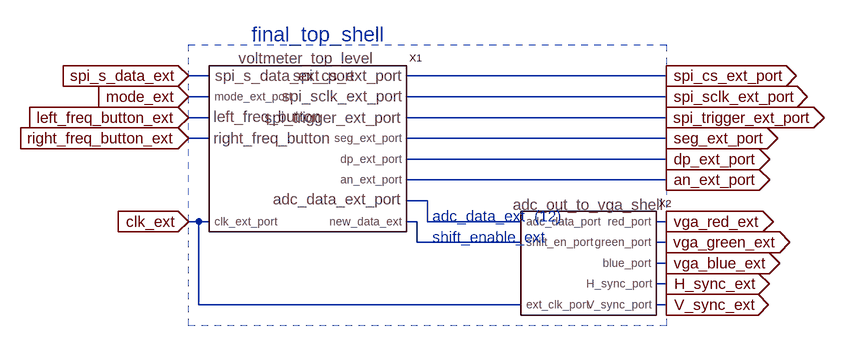
[diagram p0: schematic final_top_shell.asc]
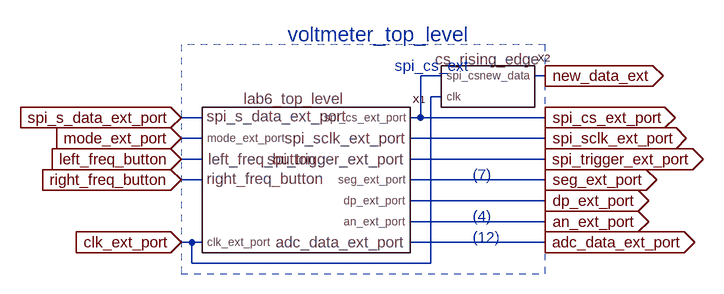
[diagram p1: sub-circuit voltmeter_shell.asc]
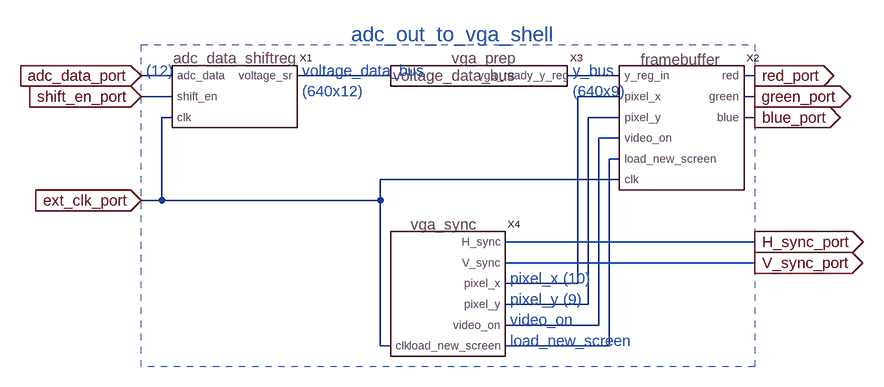
[diagram p2: sub-circuit adc_out_to_vga_shell.asc]
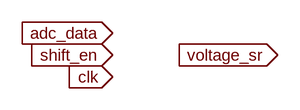
[diagram p3: sub-circuit adc_data_shiftreg.asc]
final_top_shell.asc, the LTspice schematic file:
Version 4
SHEET 1 1008 680
WIRE 48 96 16 96
WIRE 752 96 352 96
WIRE 48 128 16 128
WIRE 752 128 352 128
WIRE 48 160 16 160
WIRE 752 160 352 160
WIRE 48 192 16 192
WIRE 752 192 352 192
WIRE 752 224 352 224
WIRE 752 256 352 256
WIRE 384 288 352 288
WIRE 32 320 16 320
WIRE 48 320 32 320
WIRE 368 320 352 320
WIRE 384 320 384 288
WIRE 528 320 384 320
WIRE 752 320 736 320
WIRE 368 352 368 320
WIRE 528 352 368 352
WIRE 752 352 736 352
WIRE 752 384 736 384
WIRE 752 416 736 416
WIRE 32 448 32 320
WIRE 528 448 32 448
WIRE 752 448 736 448
FLAG 16 96 spi_s_data_ext
IOPIN 16 96 In
FLAG 16 128 mode_ext
IOPIN 16 128 In
FLAG 16 160 left_freq_button_ext
IOPIN 16 160 In
FLAG 16 192 right_freq_button_ext
IOPIN 16 192 In
FLAG 752 96 spi_cs_ext_port
IOPIN 752 96 Out
FLAG 752 128 spi_sclk_ext_port
IOPIN 752 128 Out
FLAG 752 160 spi_trigger_ext_port
IOPIN 752 160 Out
FLAG 752 192 seg_ext_port
IOPIN 752 192 Out
FLAG 752 224 dp_ext_port
IOPIN 752 224 Out
FLAG 752 320 vga_red_ext
IOPIN 752 320 Out
FLAG 752 352 vga_green_ext
IOPIN 752 352 Out
FLAG 752 384 vga_blue_ext
IOPIN 752 384 Out
FLAG 752 416 H_sync_ext
IOPIN 752 416 Out
FLAG 752 448 V_sync_ext
IOPIN 752 448 Out
FLAG 752 256 an_ext_port
IOPIN 752 256 Out
FLAG 16 320 clk_ext
IOPIN 16 320 In
SYMBOL Voltmeter_shell 240 160 R0
SYMATTR InstName X1
SYMBOL adc_out_to_vga_shell 640 336 R0
SYMATTR InstName X2
TEXT 392 344 Left 2 ;shift_enable_ext
TEXT 392 312 Left 2 ;adc_data_ext  (12)
TEXT 216 32 Center 3 ;final_top_shell
RECTANGLE Normal 752 480 16 48 2

voltmeter_shell.asc, the sub-circuit schematic file:
Version 4
SHEET 1 880 724
WIRE 416 336 384 336
WIRE 576 336 560 336
WIRE 416 368 400 368
WIRE 48 400 16 400
WIRE 384 400 384 336
WIRE 384 400 368 400
WIRE 576 400 384 400
WIRE 48 432 16 432
WIRE 576 432 368 432
WIRE 48 464 16 464
WIRE 576 464 368 464
WIRE 48 496 16 496
WIRE 576 496 368 496
WIRE 576 528 368 528
WIRE 576 560 368 560
WIRE 32 592 16 592
WIRE 48 592 32 592
WIRE 576 592 368 592
WIRE 32 624 32 592
WIRE 400 624 400 368
WIRE 400 624 32 624
FLAG 16 592 clk_ext_port
IOPIN 16 592 In
FLAG 16 400 spi_s_data_ext_port
IOPIN 16 400 In
FLAG 16 432 mode_ext_port
IOPIN 16 432 In
FLAG 576 336 new_data_ext
IOPIN 576 336 Out
FLAG 576 400 spi_cs_ext_port
IOPIN 576 400 Out
FLAG 576 432 spi_sclk_ext_port
IOPIN 576 432 Out
FLAG 576 464 spi_trigger_ext_port
IOPIN 576 464 Out
FLAG 576 496 seg_ext_port
IOPIN 576 496 Out
FLAG 576 528 dp_ext_port
IOPIN 576 528 Out
FLAG 576 560 an_ext_port
IOPIN 576 560 Out
FLAG 16 464 left_freq_button
IOPIN 16 464 In
FLAG 16 496 right_freq_button
IOPIN 16 496 In
FLAG 576 592 adc_data_ext_port
IOPIN 576 592 Out
SYMBOL lab6_top_level 192 464 R0
SYMATTR InstName X1
SYMBOL cs_rising_edge 480 352 R0
SYMATTR InstName X2
TEXT 320 272 Center 3 ;voltmeter_top_level
TEXT 464 488 Left 2 ;(7)
TEXT 464 552 Left 2 ;(4)
TEXT 464 584 Left 2 ;(12)
TEXT 344 320 Left 2 ;spi_cs_ext
RECTANGLE Normal 16 640 576 288 2

adc_out_to_vga_shell.asc, the sub-circuit schematic file:
Version 4
SHEET 1 936 680
WIRE -112 144 -160 144
WIRE 224 144 80 144
WIRE 576 144 496 144
WIRE 784 144 768 144
WIRE -112 176 -160 176
WIRE 576 176 512 176
WIRE 784 176 768 176
WIRE -112 208 -128 208
WIRE 576 208 528 208
WIRE 784 208 768 208
WIRE 576 240 544 240
WIRE 576 272 560 272
WIRE 576 304 208 304
WIRE -128 336 -128 208
WIRE -128 336 -160 336
WIRE 208 336 208 304
WIRE 208 336 -128 336
WIRE 784 400 400 400
WIRE 784 432 400 432
WIRE 512 464 512 176
WIRE 512 464 400 464
WIRE 528 496 528 208
WIRE 528 496 400 496
WIRE 544 528 544 240
WIRE 544 528 400 528
WIRE 208 560 208 336
WIRE 224 560 208 560
WIRE 560 560 560 272
WIRE 560 560 400 560
FLAG -160 336 ext_clk_port
IOPIN -160 336 In
FLAG -160 144 adc_data_port
IOPIN -160 144 In
FLAG -160 176 shift_en_port
IOPIN -160 176 In
FLAG 784 144 red_port
IOPIN 784 144 Out
FLAG 784 176 green_port
IOPIN 784 176 Out
FLAG 784 208 blue_port
IOPIN 784 208 Out
FLAG 784 400 H_sync_port
IOPIN 784 400 Out
FLAG 784 432 V_sync_port
IOPIN 784 432 Out
SYMBOL adc_data_shiftreg -16 176 R0
SYMATTR InstName X1
SYMBOL framebuffer 672 176 R0
SYMATTR InstName X2
SYMBOL vga_prep 368 144 R0
SYMATTR InstName X3
SYMBOL vga_sync 304 448 R0
SYMATTR InstName X4
TEXT 408 456 Left 2 ;pixel_x (10)
TEXT 408 488 Left 2 ;pixel_y (9)
TEXT 408 520 Left 2 ;video_on
TEXT 408 552 Left 2 ;load_new_screen
TEXT 88 136 Left 2 ;voltage_data_bus\n(640x12)
TEXT 504 136 Left 2 ;y_bus\n(640x9)
TEXT -152 136 Left 2 ;(12)
TEXT 320 80 Center 3 ;adc_out_to_vga_shell
RECTANGLE Normal 784 592 -160 96 2

adc_data_shiftreg.asc, the sub-circuit schematic file:
Version 4
SHEET 1 880 680
FLAG 160 224 clk
IOPIN 160 224 In
FLAG 160 160 adc_data
IOPIN 160 160 In
FLAG 160 192 shift_en
IOPIN 160 192 In
FLAG 256 192 voltage_sr
IOPIN 256 192 Out

The netlist it stands for:
* final_top_shell.asc
XX1 spi_cs_ext_port spi_sclk_ext_port N002 spi_trigger_ext_port seg_ext_port dp_ext_port an_ext_port clk_ext spi_s_data_ext mode_ext left_freq_button_ext right_freq_button_ext N001 voltmeter_shell
XX2 clk_ext N001 N002 vga_red_ext vga_green_ext vga_blue_ext H_sync_ext V_sync_ext adc_out_to_vga_shell

* block symbol definitions
.subckt voltmeter_shell spi_cs spi_sclk new_data_ext spi_trigger seg_ext_port dp_ext_port an_ext_port clk_ext_port spi_s_data mode_ext_port left_freq right_freq adc_data
XX1 clk_ext_port spi_cs_ext_port spi_sclk_ext_port spi_s_data_ext_port spi_trigger_ext_port mode_ext_port left_freq_button right_freq_button seg_ext_port dp_ext_port an_ext_port adc_data_ext_port lab6_top_level  ; pins clk_ext_port spi_cs_ext_port spi_sclk_ext spi_s_data spi_trigger mode_ext_port left_freq_btn right_freq_btn seg_ext_port dp_ext_port an_ext_port adc_data
XX2 spi_cs_ext_port clk_ext_port new_data_ext cs_rising_edge  ; pins spi_cs clk new_data
* voltmeter_top_level
* (7)
* (4)
* (12)
* spi_cs_ext
.ends voltmeter_shell

.subckt adc_out_to_vga_shell ext_clk_port adc_data_port shift_en_port red_port green_port blue_port H_sync_port V_sync_port
XX1 adc_data_port shift_en_port ext_clk_port N001 adc_data_shiftreg
XX2 N002 N003 N004 N005 N006 red_port green_port blue_port ext_clk_port framebuffer  ; pins y_reg_in pixel_x pixel_y video_on load_new_screen red green blue clk
XX3 N001 N002 vga_prep  ; pins V_data_bus vga_ready_y_reg
XX4 V_sync_port H_sync_port N003 N004 N005 N006 ext_clk_port vga_sync  ; pins V_sync H_sync pixel_x pixel_y video_on load_new_screen clk
* pixel_x (10)
* pixel_y (9)
* video_on
* load_new_screen
* voltage_data_bus
* (640x12)
* y_bus
* (640x9)
* (12)
* adc_out_to_vga_shell
.ends adc_out_to_vga_shell

.subckt adc_data_shiftreg adc_data shift_en clk voltage_sr
.ends adc_data_shiftreg

* shift_enable_ext
* adc_data_ext  (12)
* final_top_shell
.backanno
.end